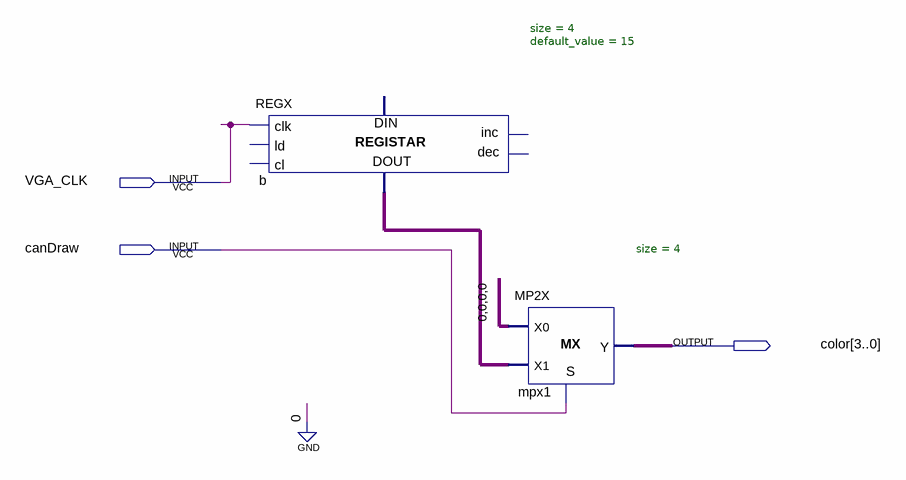
[diagram p0: schematic sheet]
// Quartus schematic color.bdf as structural Verilog: 2 symbols, 3 pins
module color (
  input  VGA_CLK,
  input  canDraw,
  output [3:0] color
);

  wire [3:0] b_data_out;

  REGX #(.size(4), .default_value(15)) b (.clk(VGA_CLK), .data_out(b_data_out));  // open: ld, cl, inc, dec, data_in
  MP2X #(.size(4)) mpx1 (.S(canDraw), .X0(4'b0000), .X1(b_data_out), .Y(color));
endmodule
